# EAGLE design controllerBackup (EAGLE 9.2.2)
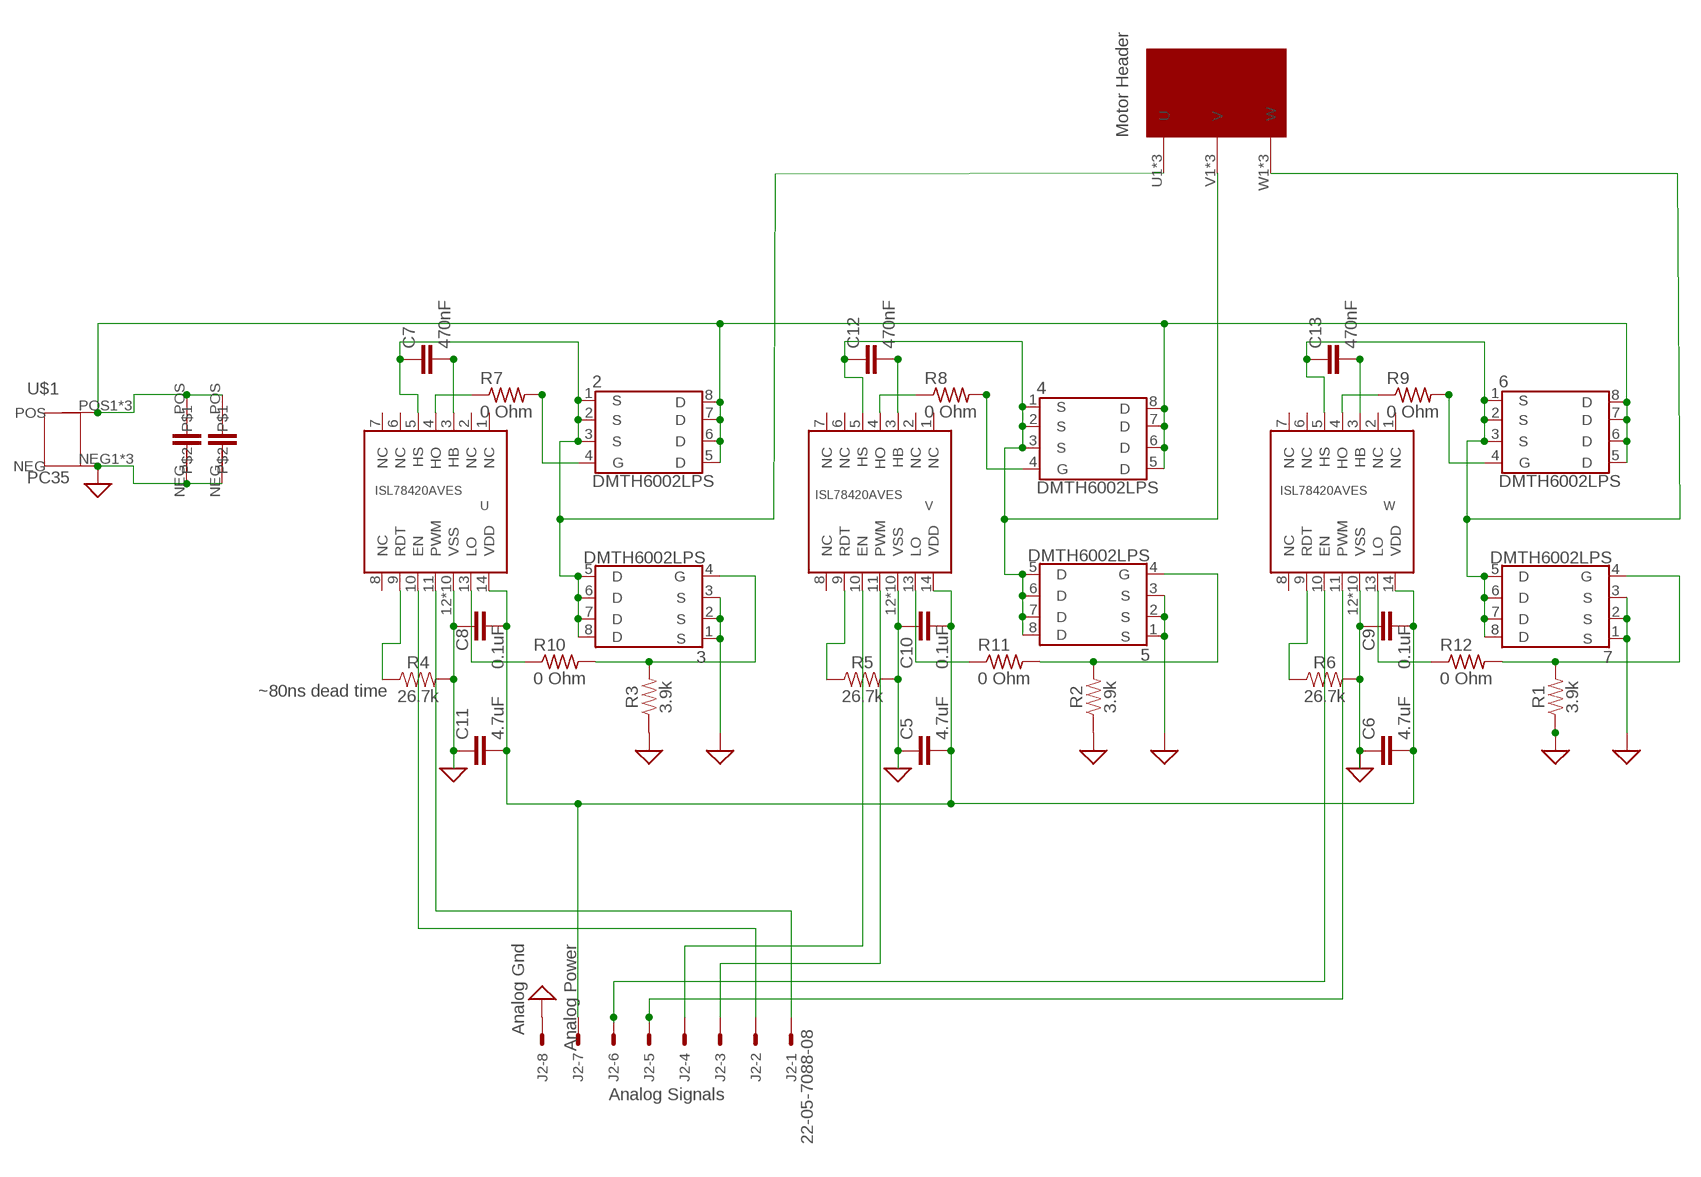
[diagram p0: schematic, sheet 1]

## Parts
2  DMTH6002LPS  [POWERDI5060]
3  DMTH6002LPS  [POWERDI5060]
4  DMTH6002LPS  [POWERDI5060]
5  DMTH6002LPS  [POWERDI5060]
6  DMTH6002LPS  [POWERDI5060]
7  DMTH6002LPS  [POWERDI5060]
C5  4.7uF  4.7UF0603  [0603]
C6  4.7uF  4.7UF0603  [0603]
C7  470nF  470NF-0402-16V-10%  [0402]
C8  0.1uF  0.1UF-0603-25V-(+80/-20%)  [0603]
C9  0.1uF  0.1UF-0603-25V-(+80/-20%)  [0603]
C10  0.1uF  0.1UF-0603-25V-(+80/-20%)  [0603]
C11  4.7uF  4.7UF0603  [0603]
C12  470nF  470NF-0402-16V-10%  [0402]
C13  470nF  470NF-0402-16V-10%  [0402]
J2  22-05-7088-08  [7395-08]
R1  3.9k  3.9KOHM-0603-1/10W-1%  [0603]
R2  3.9k  3.9KOHM-0603-1/10W-1%  [0603]
R3  3.9k  3.9KOHM-0603-1/10W-1%  [0603]
R4  26.7k  26.7KOHM0603-1/10W-1%  [0603]
R5  26.7k  26.7KOHM0603-1/10W-1%  [0603]
R6  26.7k  26.7KOHM0603-1/10W-1%  [0603]
R7  0 Ohm  R-US_R0603  [R0603]
R8  0 Ohm  R-US_R0603  [R0603]
R9  0 Ohm  R-US_R0603  [R0603]
R10  0 Ohm  R-US_R0603  [R0603]
R11  0 Ohm  R-US_R0603  [R0603]
R12  0 Ohm  R-US_R0603  [R0603]
U  ISL78420AVES  [14LDHTSSOP]
U$1  PC35  [PC35.1762741]
U$2  PC35_3  [PC35.1762754]
U$3  1mF 63V  VISHAYCAP  [MAL2146998]
U$4  1mF 63V  VISHAYCAP  [MAL2146998]
V  ISL78420AVES  [14LDHTSSOP]
W  ISL78420AVES  [14LDHTSSOP]

## Nets
0: 2.1(S) 2.2(S) 2.3(S) 3.5(D) 3.6(D) 3.7(D) 3.8(D) C7.1 U$2.U1(U) U$2.U2(U) U$2.U3(U) U.5(HS)
GND: 3.1(S) 3.2(S) 3.3(S) 5.1(S) 5.2(S) 5.3(S) 7.1(S) 7.2(S) 7.3(S) C5.1 C6.1 C8.1 C9.1 C10.1 C11.1 J2.8 R1.1 R2.1 R3.1 R4.2 R5.2 R6.2 U$1.NEG1(NEG) U$1.NEG2(NEG) U$1.NEG3(NEG) U$3.NEG U$4.NEG U.12(VSS) U.EPAD(VSS) U.P$1(VSS) U.P$2(VSS) U.P$3(VSS) U.P$4(VSS) U.P$5(VSS) U.P$6(VSS) U.P$7(VSS) U.P$8(VSS) V.12(VSS) V.EPAD(VSS) V.P$1(VSS) V.P$2(VSS) V.P$3(VSS) V.P$4(VSS) V.P$5(VSS) V.P$6(VSS) V.P$7(VSS) V.P$8(VSS) W.12(VSS) W.EPAD(VSS) W.P$1(VSS) W.P$2(VSS) W.P$3(VSS) W.P$4(VSS) W.P$5(VSS) W.P$6(VSS) W.P$7(VSS) W.P$8(VSS) ; supply symbol labelled SUP
N$1: J2.1 U.11(PWM)
N$2: R10.1 U.13(LO)
N$3: C5.2 C6.2 C8.2 C9.2 C10.2 C11.2 J2.7 U.14(VDD) V.14(VDD) W.14(VDD)
N$4: C7.2 U.3(HB)
N$5: J2.2 U.10(EN)
N$6: 4.4(G) R8.2
N$7: 2.4(G) R7.2
N$8: 3.4(G) R3.2 R10.2
N$9: J2.3 V.11(PWM)
N$11: J2.4 V.10(EN)
N$12: 5.4(G) R2.2 R11.2
N$13: 6.4(G) R9.2
N$15: 7.4(G) R1.2 R12.2
N$16: 4.1(S) 4.2(S) 4.3(S) 5.5(D) 5.6(D) 5.7(D) 5.8(D) C12.1 U$2.V1(V) U$2.V2(V) U$2.V3(V) V.5(HS)
N$17: C12.2 V.3(HB)
N$18: C13.2 W.3(HB)
N$19: 6.1(S) 6.2(S) 6.3(S) 7.5(D) 7.6(D) 7.7(D) 7.8(D) C13.1 U$2.W1(W) U$2.W2(W) U$2.W3(W) W.5(HS)
N$25: R4.1 U.9(RDT)
N$26: R5.1 V.9(RDT)
N$27: R6.1 W.9(RDT)
N$28: R8.1 V.4(HO)
N$29: R9.1 W.4(HO)
N$30: J2.5 W.11(PWM)
N$31: J2.6 W.10(EN)
N$35: R11.1 V.13(LO)
N$37: R12.1 W.13(LO)
N$38: R7.1 U.4(HO)
N$41: 2.5(D) 2.6(D) 2.7(D) 2.8(D) 4.5(D) 4.6(D) 4.7(D) 4.8(D) 6.5(D) 6.6(D) 6.7(D) 6.8(D) U$1.POS1(POS) U$1.POS2(POS) U$1.POS3(POS) U$3.POS U$4.POS
Unconnected: U.1(NC) U.2(NC) U.6(NC) U.7(NC) U.8(NC) V.1(NC) V.2(NC) V.6(NC) V.7(NC) V.8(NC) W.1(NC) W.2(NC) W.6(NC) W.7(NC) W.8(NC)

## Notes on the sheet
- ~80ns dead time
- Analog Gnd
- Analog Power
- Analog Signals

## Library data of the parts
2-7 = MC:DMTH6002LPS: Diodes Inc. N-channel MOSFET 60V, 100A
C5 C6 C11 = SparkFun-Capacitors:4.7UF: 4.7µF ceramic capacitors A capacitor is a passive two-terminal electrical component used to store electrical energy temporarily in an electric field.; PROD_ID: CAP-08280
C7 C12 C13 = SparkFun-Capacitors:470NF: 0.47uF/470nF ceramic capacitors A capacitor is a passive two-terminal electrical component used to store electrical energy temporarily in an electric field.; PROD_ID: CAP-09041
C8-C10 = SparkFun-Capacitors:0.1UF: 0.1µF ceramic capacitors A capacitor is a passive two-terminal electrical component used to store electrical energy temporarily in an electric field.; PROD_ID: CAP-00810
J2 = con-molex:22-?-08: CONNECTOR wire to board 2.54 mm (.1 inch) pitch header; MF: MOLEX; OC_FARNELL: unknown; OC_NEWARK: unknown
R1-R3 = SparkFun-Resistors:3.9KOHM: 3.9kΩ resistor A resistor is a passive two-terminal electrical component that implements electrical resistance as a circuit element. Resistors act to reduce current flow, and, at the same time, act to lower voltage levels within circuits. - Wikipedia; PROD_ID: RES-08701
R4-R6 = SparkFun-Resistors:26.7KOHM: 26.7kΩ resistor A resistor is a passive two-terminal electrical component that implements electrical resistance as a circuit element. Resistors act to reduce current flow, and, at the same time, act to lower voltage levels within circuits. - Wikipedia; PROD_ID: RES-12186
R7-R12 = adafruit:R-US_: RESISTOR, American symbol
U V W = MC:ISL78420AVES: Renesas Gate Driver 100V, 2A Peak, adjustable dead time
U$1 = MC:PC35
U$2 = MC:PC35_3
U$3 U$4 = MC:VISHAYCAP

## Board
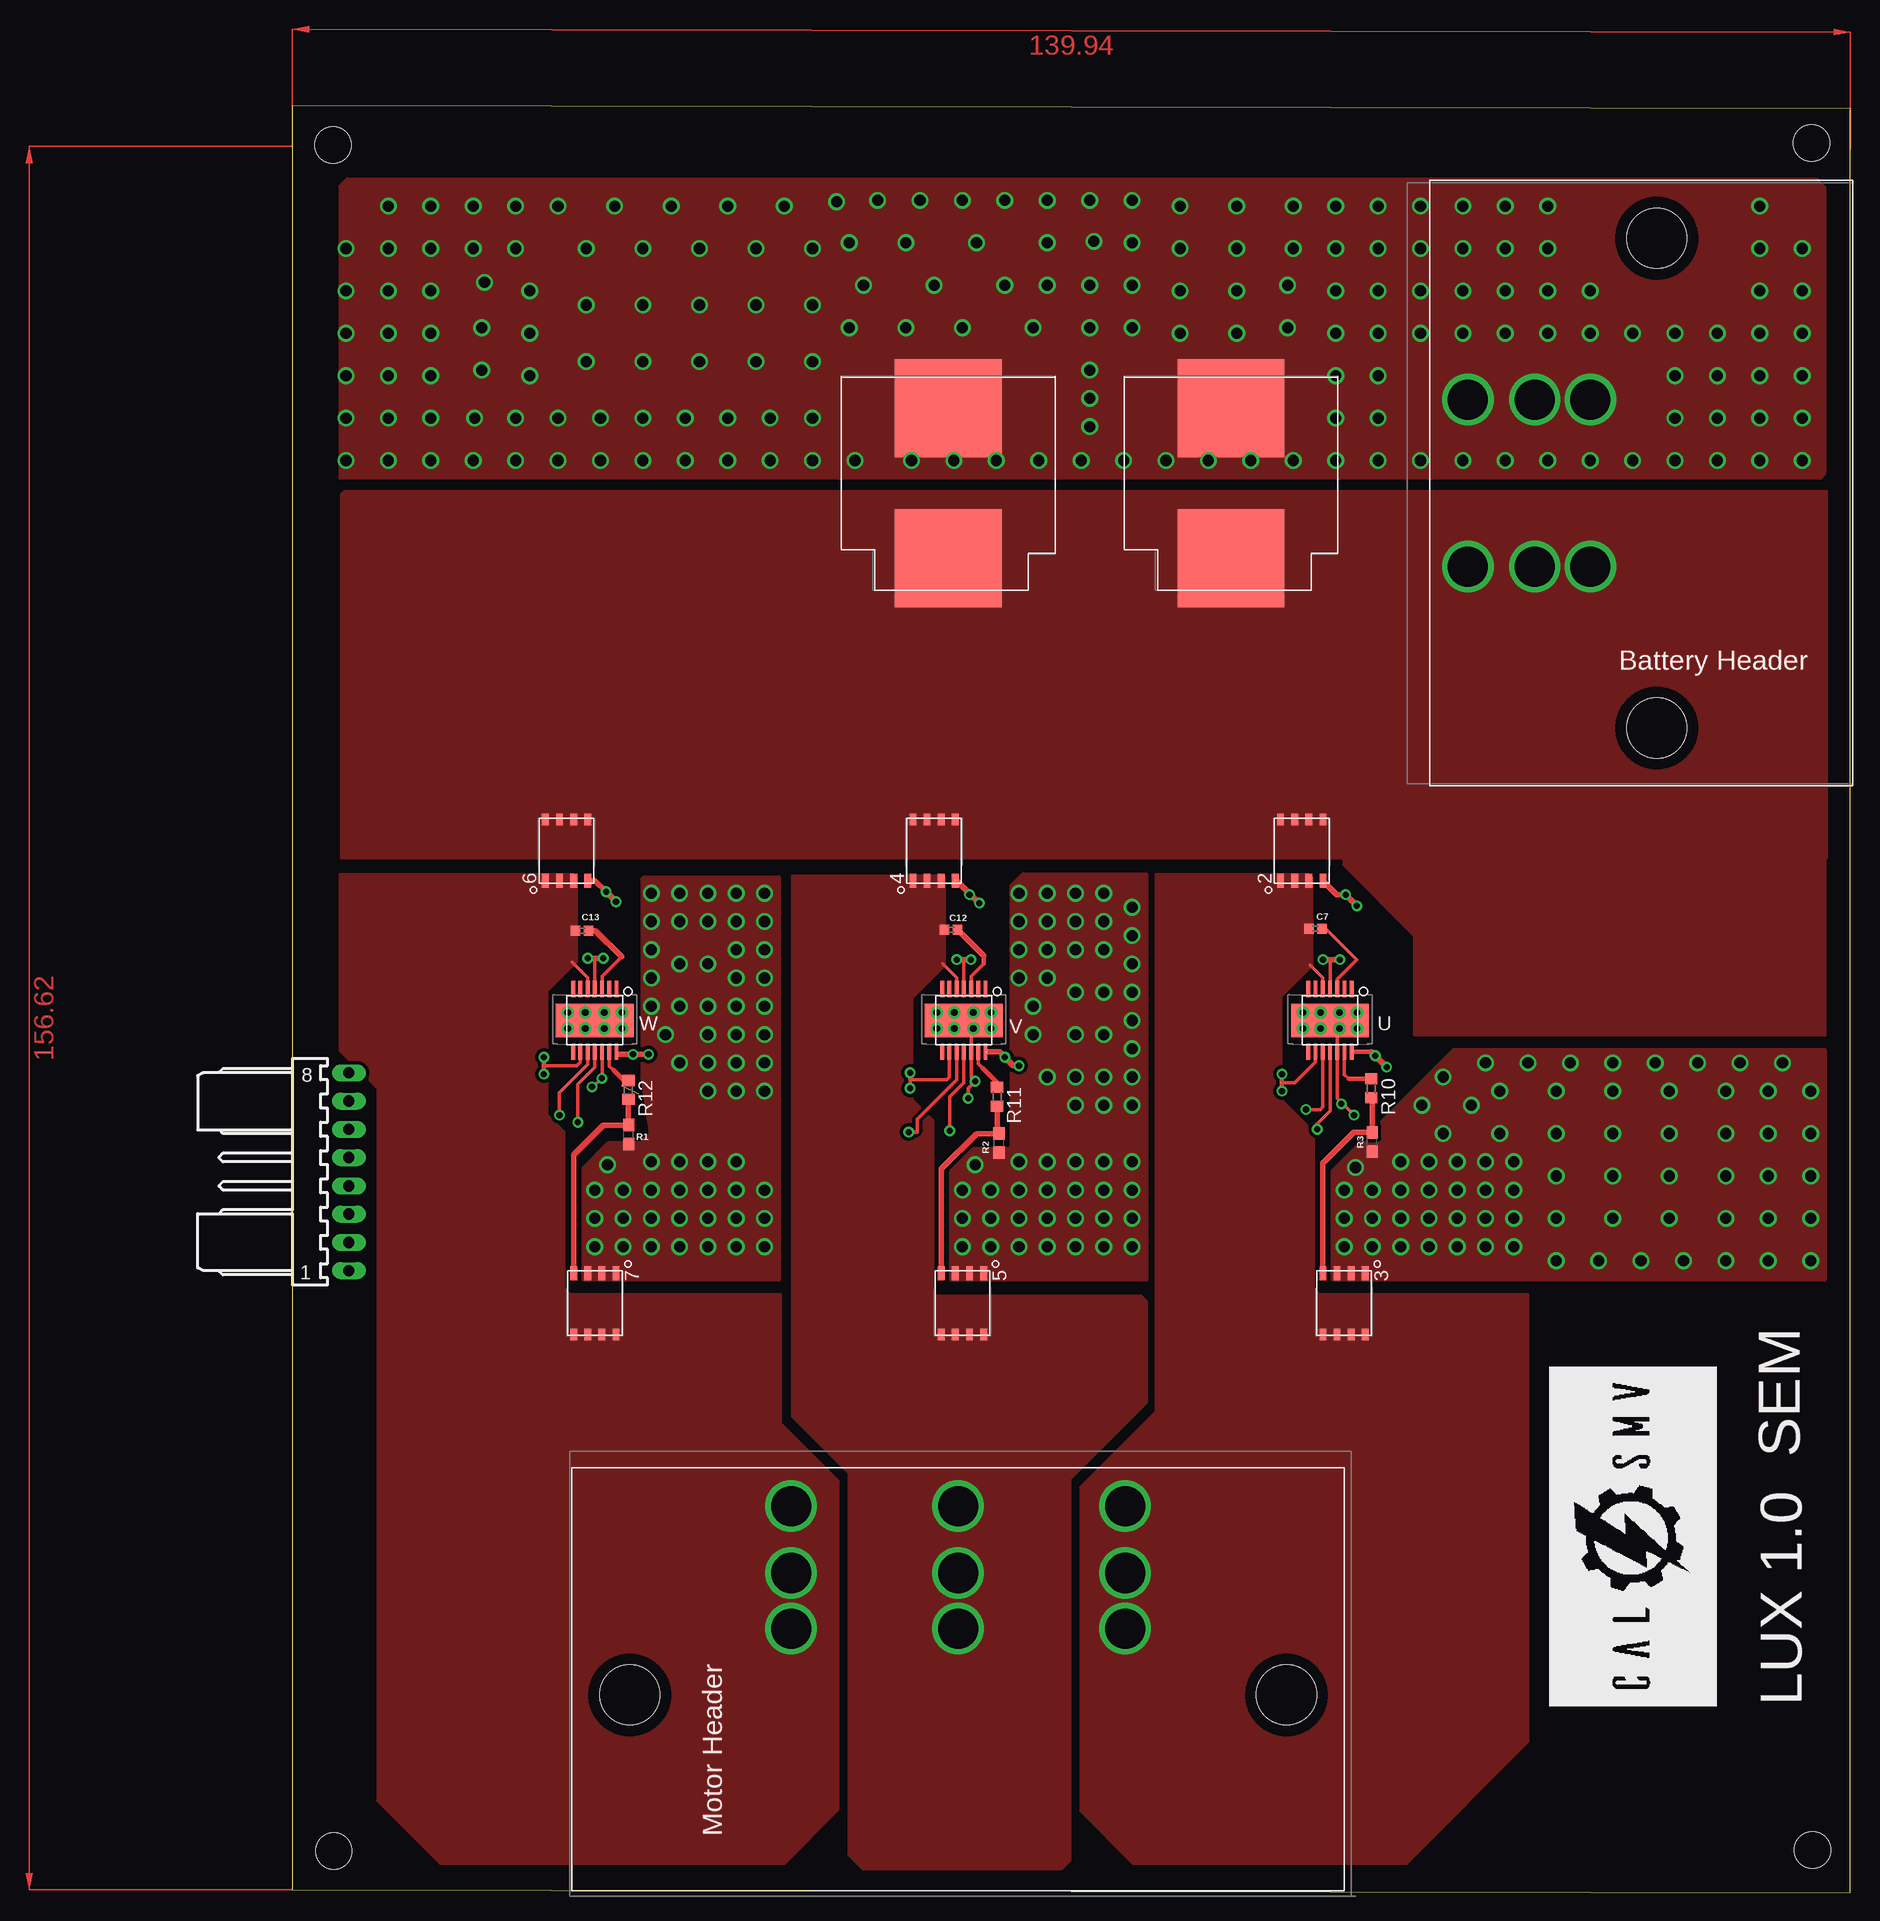
[diagram p1: board, top side]
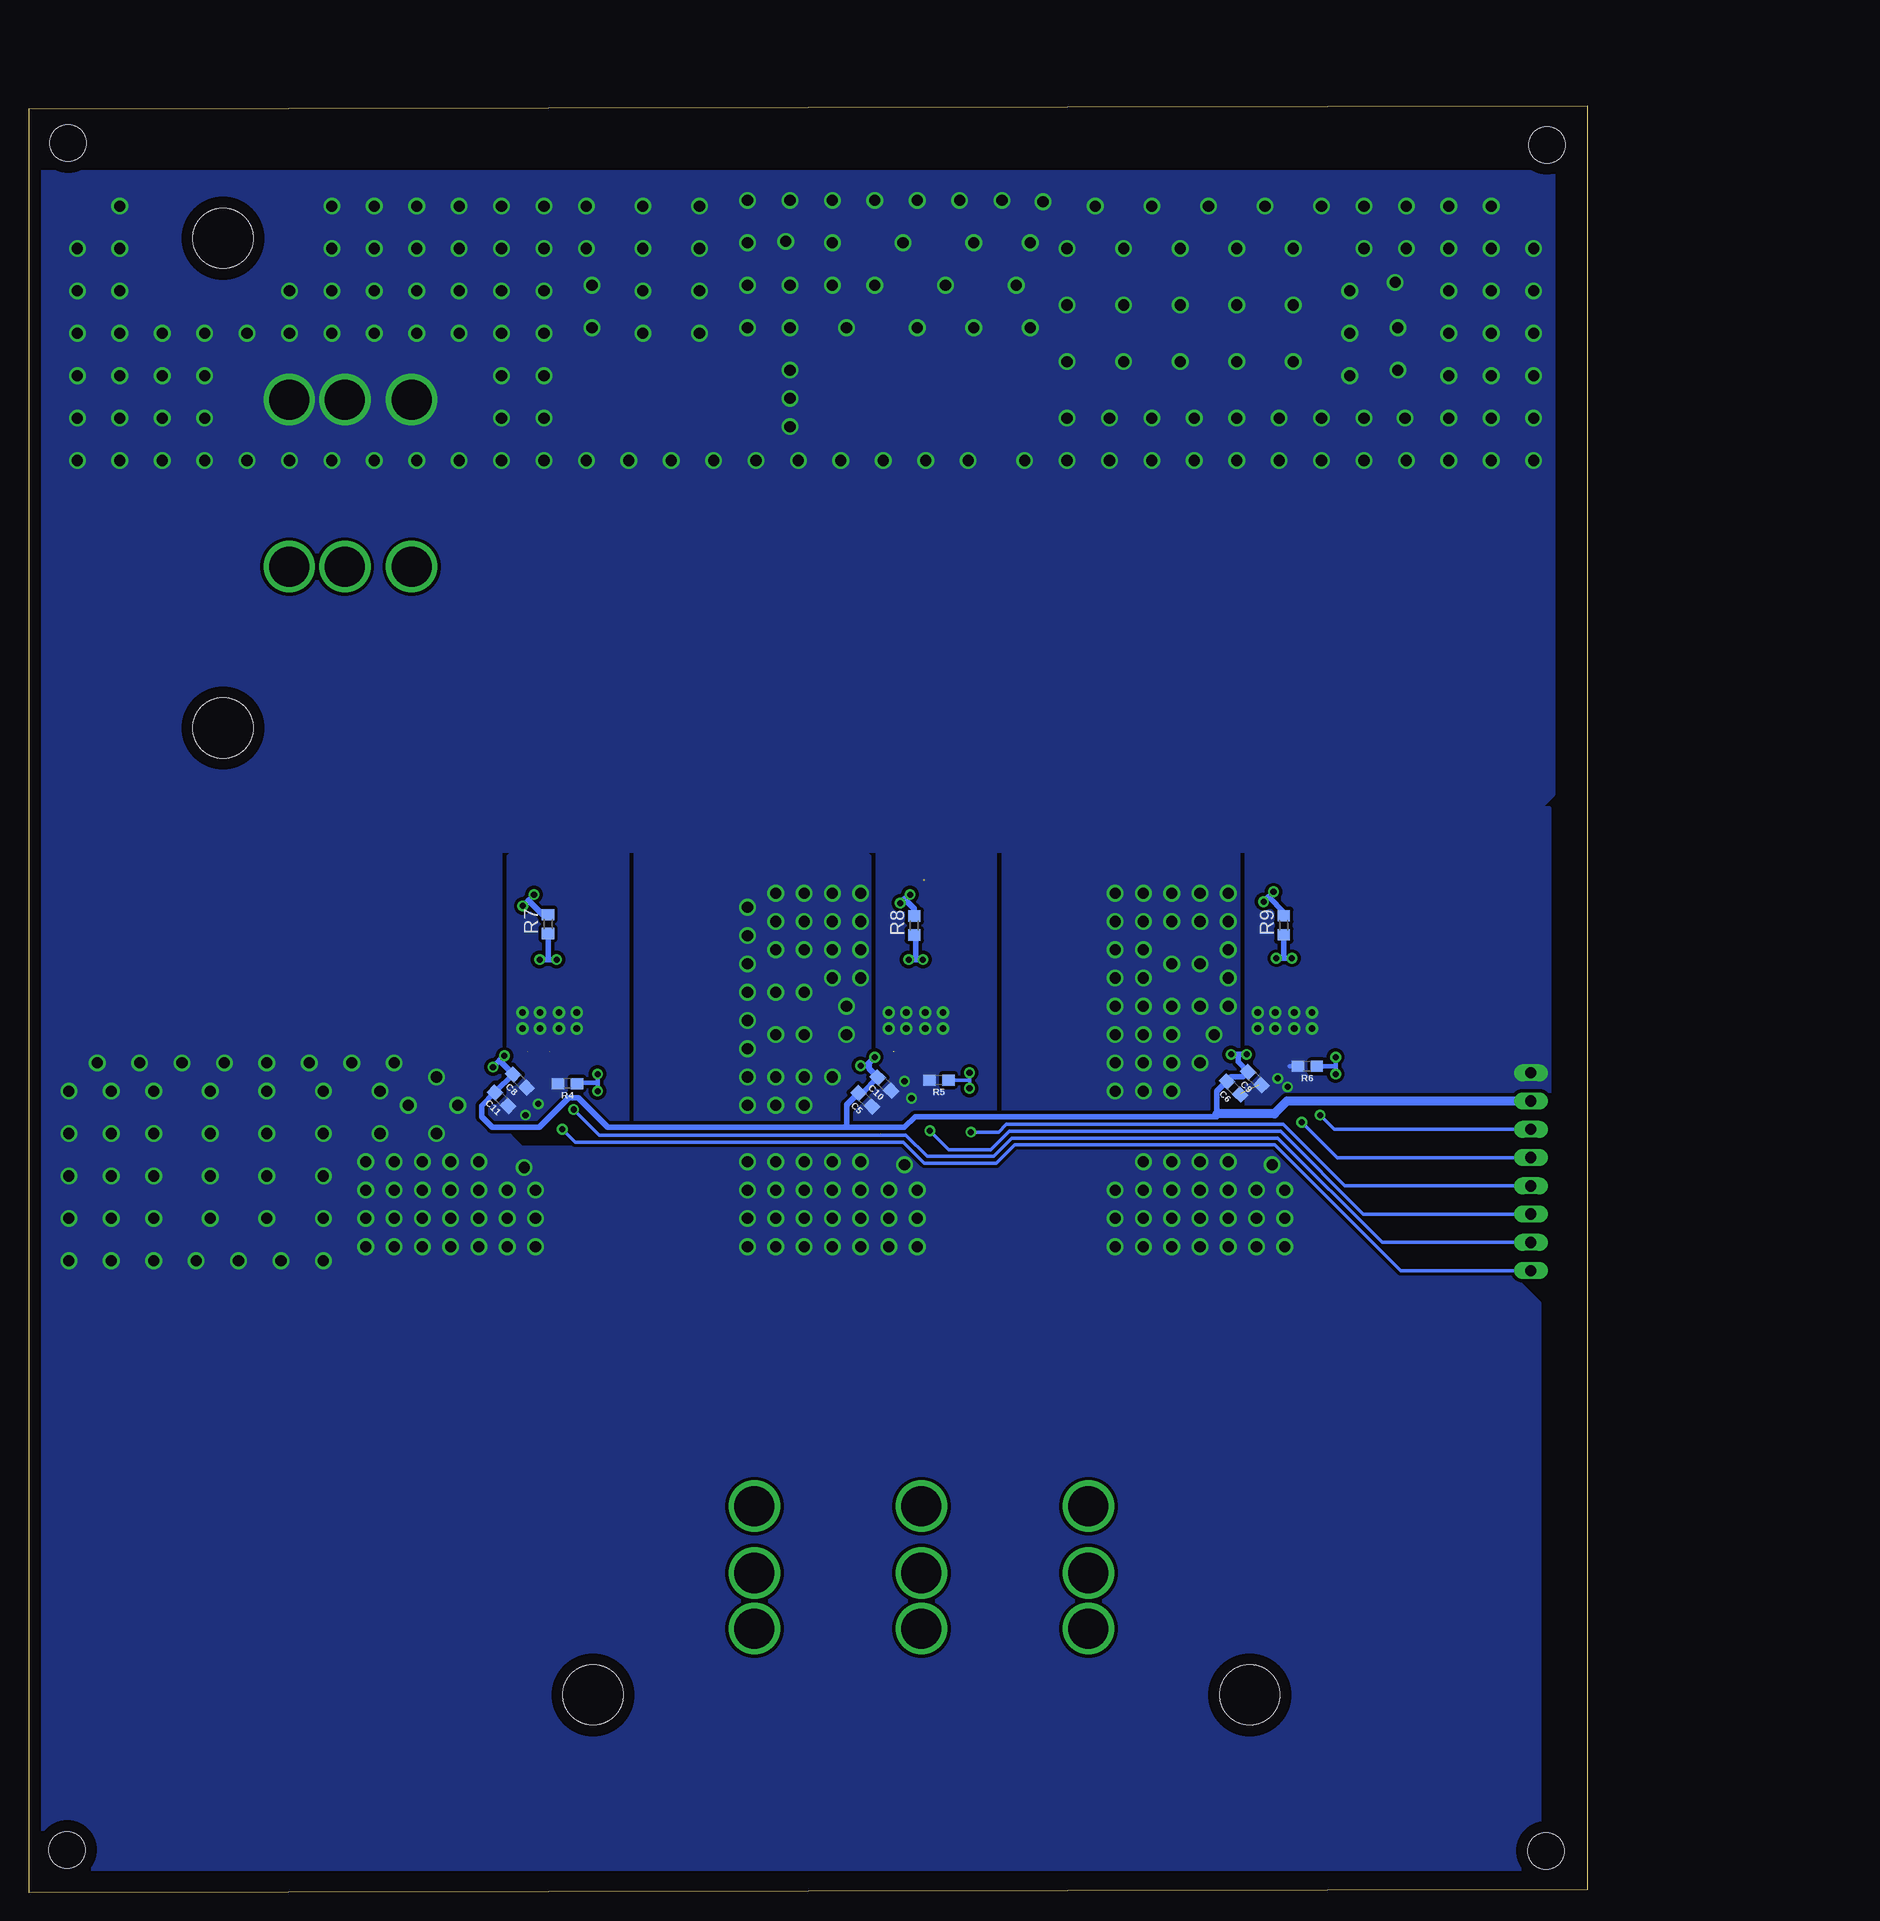
[diagram p2: board, bottom side, seen from below]

Size 139.94 x 160.51 mm. Coordinates in mm from the lower left corner, seen from the top.
Outline: 0,0.25 139.94,0 139.94,160.26 0,160.51 0,0.25
Copper layers (1*16): Top 0.035mm / dielectric 1.5mm / Bottom 0.035mm
Design rules "default *": minimum track width 12mil, minimum drill 10mil, track to track 12mil, track to pad 8mil, pad to pad 8mil, via to via 12mil, smd to smd 12mil, copper to edge 40mil, drill to drill 8mil, minimum pad ring 10mil, minimum via ring 8mil, stop-mask expansion 4mil, vias tented up to drill 0mil, thermal gap 10mil
Holes 3.26 mm at 3.73,3.77 136.55,3.85 136.47,157.17 3.64,157

### Footprints (pad centres in the part's own frame; a part is rotated, then mirrored left to right if it is on the bottom)
POWERDI5060 = smd 1.27 x 0.61: 1 -2.68,1.905; 2 -2.68,0.635; 3 -2.68,-0.635; 4 -2.68,-1.905 | smd 1.02 x 0.61: 5 2.795,-1.905; 6 2.795,-0.635; 7 2.795,0.635; 8 2.795,1.905
0603 = smd 1.1 x 1: 1 -0.85,0; 2 0.85,0
0402 = smd 0.85 x 0.9: 1 -0.58,0; 2 0.58,0
7395-08 = drill 1.016 long: 1 8.89,0; 2 6.35,0; 3 3.81,0; 4 1.27,0; 5 -1.27,0; 6 -3.81,0; 7 -6.35,0; 8 -8.89,0
R0603 = smd 1 x 1.1: 1 -0.85,0; 2 0.85,0
14LDHTSSOP = smd 0.35 x 1.45: 1 -1.95,-2.825; 2 -1.3,-2.825; 3 -0.65,-2.825; 4 0,-2.825; 5 0.65,-2.825; 6 1.3,-2.825; 7 1.95,-2.825; 8 1.95,2.825; 9 1.3,2.825; 10 0.65,2.825; 11 0,2.825; 12 -0.65,2.825; 13 -1.3,2.825; 14 -1.95,2.825 | smd 7 x 3: EPAD 0,0 | drill 0.6: P$1 0.854,0.727; P$2 2.435,0.727; P$3 -0.854,0.727; P$4 -2.435,0.727; P$5 -2.435,-0.727; P$6 -0.854,-0.727; P$7 0.854,-0.727; P$8 2.435,-0.727
PC35.1762741 = drill 3.6: NEG1 4.55,-7.5; NEG2 9.55,-7.5; NEG3 15.55,-7.5; POS1 4.55,7.5; POS2 9.55,7.5; POS3 15.55,7.5 | hole 5.4: -1.4,22; -1.4,-22
PC35.1762754 = drill 3.6: U1 4.55,-15; U2 9.55,-15; U3 15.55,-15; V1 4.55,0; V2 9.55,0; V3 15.55,0; W1 4.55,15; W2 9.55,15; W3 15.55,15 | hole 5.4: -1.4,29.5; -1.4,-29.5
MAL2146998 = smd 8.8 x 9.6: NEG 6.75,0; POS -6.75,0

### Placement (x,y rotation side)
2  90.68,93.6 90 top
3  94.49,52.96 270 top
4  57.66,93.6 90 top
5  60.2,52.96 270 top
6  24.64,93.6 90 top
7  27.18,52.96 270 top
C5  64.87,71.24 135 bottom
C6  31.79,72.29 135 bottom
C7  91.9,86.61 0 top
C8  95.89,72.92 135 bottom
C9  29.88,73.15 135 bottom
C10  63.14,72.65 135 bottom
C11  97.54,71.29 135 bottom
C12  59.18,86.5 0 top
C13  26.03,86.43 0 top
J2  5.08,64.77 270 top
R1  30.23,68.11 90 top
R2  63.49,67.35 90 top
R3  97.01,67.44 90 top
R4  91.61,72.68 180 bottom
R5  58.24,72.99 180 bottom
R6  25.15,74.24 180 bottom
R7  93.36,87.02 90 bottom
R8  60.47,86.88 90 bottom
R9  27.26,86.91 90 bottom
R10  96.93,72.26 270 top
R11  63.31,71.5 270 top
R12  30.2,72.11 270 top
U  93.22,78.36 180 top
U$1  121.16,126.62 180 top
U$2  59.82,19.18 90 top
U$3  84.33,126.62 90 top
U$4  58.93,126.62 90 top
V  60.32,78.36 180 top
W  27.18,78.36 180 top

### Tracks (layer width: path | path; a pad name or v marks a point on that pad's centre or on a via)
0
  Top 0.305: U.5 92.57,82.18 91.44,83.31
  pour Top (no thermals): 91.57,91.19 91.57,83.31 88.77,80.52 88.77,71.25 91.69,68.33 91.69,54.23 92.2,53.72 111,53.72 111,13.59 100.08,2.67 75.56,2.67 70.87,7.37 70.87,36.45 77.6,43.18 77.6,91.44 91.31,91.44
GND  (via drill 0.55, 1)  (1 unrouted)
  Top 0.305: W.12 27.83,73.17 27.05,72.39 v26.92,72.39 | v95.38,69.85 93.87,71.36 U.12 93.87,77.43 U.P$3 | v60.71,71.37 60.71,72.26 v61.34,72.9 60.97,73.26 V.12 60.97,77.43 V.P$3
  Top 0.406: 27.83,73.17 v27.81,73.15
  Bottom 0.305: R4.2 92.5,72.64
  Bottom 0.406: 63.95,70.64 C5.1 | C9.1 29.25,72.52 | C9.1 29.53,72.55 | R6.2 26.73,74.24 | C9.1 29.12,72.39
  Bottom 0.508: C6.1 31.12,71.75
  other vias: 17.27,144.65 75.44,148.21 17.02,140.59 16.38,132.46 75.44,144.4 48.89,151.89 52.58,152.02 60.2,152.02 17.02,136.78 56.39,152.02 94.49,58.04 104.65,65.66 97.03,58.04 99.57,58.04 102.11,65.66 99.57,65.66 50.04,148.21 51.31,144.4 71.63,140.59 66.55,140.59 60.2,140.59 55.12,140.59 50.04,140.59 57.66,144.4 64.01,144.4 71.63,144.4 72.01,148.34 67.82,148.21 61.47,148.21 55.12,148.21 135.64,128.65 94.49,60.58 104.65,58.04 102.11,58.04 102.11,60.58 99.57,60.58 97.03,60.58 104.65,60.58 104.65,63.12 102.11,63.12 99.57,63.12 97.03,63.12 94.49,63.12 107.19,65.66 107.19,58.04 107.19,60.58 107.19,63.12 109.73,65.66 109.73,58.04 109.73,60.58 109.73,63.12 94.23,70.87 95.5,65.15 60.2,58.04 70.36,65.66 62.74,58.04 65.28,58.04 67.82,65.66 65.28,65.66 60.2,60.58 70.36,58.04 67.82,58.04 67.82,60.58 65.28,60.58 62.74,60.58 70.36,60.58 70.36,63.12 67.82,63.12 65.28,63.12 62.74,63.12 60.2,63.12 72.9,65.66 72.9,58.04 72.9,60.58 72.9,63.12 61.34,65.41 75.44,58.04 75.44,60.58 75.44,63.12 89.41,144.4 27.18,58.04 37.34,65.66 29.72,58.04 32.26,58.04 34.8,65.66 32.26,65.66 27.18,60.58 37.34,58.04 34.8,58.04 34.8,60.58 32.26,60.58 29.72,60.58 37.34,60.58 37.34,63.12 34.8,63.12 32.26,63.12 29.72,63.12 27.18,63.12 39.88,65.66 39.88,58.04 39.88,60.58 39.88,63.12 28.32,65.41 42.42,58.04 42.42,60.58 42.42,63.12 89.41,140.59 131.83,128.65 128.02,128.65 124.21,128.65 120.4,128.65 116.59,128.65 112.78,128.65 108.97,128.65 105.16,128.65 101.35,128.65 97.54,128.65 93.73,128.65 89.92,128.65 86.11,128.65 82.3,128.65 78.49,128.65 74.68,128.65 70.87,128.65 67.06,128.65 63.25,128.65 59.44,128.65 55.63,128.65 50.55,128.65 135.64,132.46 135.64,136.27 135.64,140.08 135.64,143.89 135.64,147.7 131.83,151.51 112.78,151.51 108.97,151.51 131.83,132.46 128.02,132.46 128.02,136.27 128.02,140.08 131.83,140.08 131.83,136.27 131.83,143.89 131.83,147.7 124.21,140.08 124.21,136.27 124.21,132.46 120.4,140.08 116.59,140.08 112.78,140.08 108.97,140.08 105.16,140.08 101.35,140.08 116.59,143.89 112.78,143.89 112.78,147.7 108.97,143.89 108.97,147.7 105.16,143.89 105.16,147.7 105.16,151.51 101.35,151.51 101.35,147.7 101.35,143.89 97.54,132.46 97.54,136.27 97.54,140.08 97.54,143.89 97.54,147.7 97.54,151.51 93.73,151.51 89.92,151.51 93.73,147.7 93.73,143.89 93.73,140.08 93.73,136.27 93.73,132.46 46.74,128.65 42.93,128.65 39.12,128.65 35.31,128.65 31.5,128.65 27.69,128.65 23.88,128.65 20.07,128.65 16.26,128.65 12.45,128.65 8.64,128.65 4.83,128.65 4.83,132.46 4.83,136.27 4.83,140.08 4.83,143.89 4.83,147.7 8.64,151.51 12.45,151.51 16.26,151.51 20.07,151.51 23.88,151.51 8.64,132.46 8.64,136.27 8.64,140.08 8.64,143.89 8.64,147.7 12.45,147.7 12.45,143.89 12.45,140.08 12.45,136.27 12.45,132.46 20.07,132.46 21.34,136.27 21.34,140.08 21.34,143.89 20.07,147.7 84.84,151.51 79.76,151.51 89.92,147.7 84.84,147.7 79.76,147.7 84.84,143.89 84.84,140.08 79.76,140.08 79.76,143.89 71.63,134.24 28.96,151.51 34.04,151.51 39.12,151.51 44.2,151.51 46.74,132.46 46.74,137.54 46.74,142.62 41.66,142.62 41.66,137.54 39.12,132.46 35.31,132.46 31.5,132.46 27.69,132.46 26.42,137.54 31.5,137.54 36.58,137.54 36.58,142.62 31.5,142.62 26.42,142.62 26.42,147.7 41.66,147.7 46.74,147.7 36.58,147.7 31.5,147.7 113.54,56.77 117.35,56.77 121.16,56.77 124.97,56.77 128.78,56.77 132.59,56.77 136.4,56.77 136.4,60.58 136.4,64.39 136.4,68.2 136.4,72.01 133.86,74.55 130.05,74.55 126.24,74.55 122.43,74.55 118.62,74.55 114.81,74.55 111,74.55 107.19,74.55 103.38,73.28 101.47,70.74 113.54,60.58 113.54,64.39 113.54,68.2 118.62,68.2 123.7,68.2 128.78,68.2 132.59,60.58 132.59,64.39 128.78,64.39 123.7,64.39 118.62,64.39 118.62,60.58 123.7,60.58 128.78,60.58 132.59,68.2 132.59,72.01 128.78,72.01 123.7,72.01 118.62,72.01 113.54,72.01 108.46,72.01 108.46,68.2 103.38,68.2 105.92,70.74 75.44,65.66 75.44,70.74 72.9,70.74 70.36,70.74 75.44,73.28 72.9,73.28 70.36,73.28 67.82,73.28 66.55,77.09 75.44,75.82 75.44,78.36 75.44,80.9 75.44,83.44 75.44,85.98 75.44,88.52 72.9,89.79 70.36,89.79 67.82,89.79 65.28,89.79 65.28,87.25 65.28,84.71 65.28,82.17 66.55,79.63 72.9,77.09 72.9,80.9 72.9,84.71 72.9,87.25 70.36,77.09 70.36,80.9 70.36,84.71 70.36,87.25 67.82,87.25 67.82,84.71 67.82,82.17 39.88,72.01 37.34,72.01 39.88,74.55 37.34,74.55 34.8,74.55 39.88,77.09 39.88,79.63 39.88,82.17 39.88,84.71 39.88,87.25 39.88,89.79 37.34,89.79 34.8,89.79 32.26,89.79 32.26,87.25 32.26,84.71 32.26,82.17 32.26,79.63 33.53,77.09 37.34,77.09 37.34,79.63 34.8,79.63 37.34,83.44 34.8,83.44 34.8,87.25 37.34,87.25 71.63,136.78 71.63,131.7 75.44,140.59 23.88,132.46 42.93,132.46 64.01,152.02 67.82,152.02 71.63,152.02 75.44,152.02 67.82,144.4 16.26,147.7 42.42,72.01 42.42,74.55 42.42,77.09 42.42,79.63 42.42,82.17 42.42,84.71 42.42,87.25 42.42,89.79
  pour Top (no thermals): 59.18,55.12 59.18,64.77 61.21,66.8 64.64,66.8 64.64,90.42 65.66,91.44 76.71,91.44 76.71,55.12
  pour Top (no thermals): 26.16,55.12 26.16,65.02 28.45,67.31 31.37,67.31 32.26,68.2 31.48,73.25 31.48,91.04 31.62,91.19 35.81,91.19 43.69,91.18 43.69,55.12
  pour Top (no thermals): 93.47,55.12 93.47,64.77 104.39,75.69 137.67,75.69 137.67,55.12
  pour Top (no thermals): 4.32,127.13 137.29,127.13 137.67,127.51 137.67,153.16 136.91,153.92 4.95,153.92 4.32,153.29
  pour Bottom (no thermals): 18.29,66.93 4.32,52.96 4.32,2.16 138.94,2.16 138.94,154.56 3.05,154.56 3.05,98.68 8.13,93.6 97.66,93.6 97.66,68.83 95.76,66.93
  pour Bottom (no thermals): 30.58,94.01 30.58,69.25 5.81,69.25 3.44,71.61 3.44,97.41 27.18,97.41
  pour Bottom: 33.53,69.47 52.58,69.47 52.58,94.87 31.88,94.87 31.24,94.23 31.24,74.3 33.53,72.01
  pour Bottom: 66.55,68.2 85.6,68.2 85.6,93.6 64.9,93.6 64.39,93.09 64.39,72.9 66.55,70.74
  pour Bottom (no thermals): 53.09,93.85 53.09,69.6 60.71,69.6 61.47,68.83 66.04,68.83 66.17,68.96 66.17,69.85 63.86,72.16 63.86,93.5 63.5,93.85
  pour Bottom (no thermals): 86.11,93.6 86.11,69.34 86.87,68.58 99.06,68.58 99.19,68.71 99.19,69.6 97.03,71.75 97.03,93.09 96.52,93.6
N$1  (via drill 0.55)  (1 unrouted)
  Top 0.305: U.11 93.22,70.23 92.08,69.09 v92.08,68.58
  Bottom 0.305: J2.1 16.76,55.88 28.07,67.18 51.43,67.18 53.09,65.53 59.56,65.53 61.47,67.44 90.93,67.44 v92.08,68.58
N$2
  Top 0.305: 96.89,73.15 R10.1 | U.13 94.52,73.49 94.9,73.1
  Top 0.406: 94.9,73.1 R10.1
N$3  (via drill 0.55)  (2 unrouted)
  Top 0.305: W.14 29.35,75.31
  Top 0.406: 96.93,75.53 95.2,75.53
  Top 0.508: v32,75.31 v30.61,75.31 29.35,75.31 | v98.3,74.17 v97.28,75.18 96.93,75.53 | v65.28,74.3 64.77,74.3 v64.01,75.06 63.53,75.53 62.34,75.53
  Bottom 0.406: 65.15,71.84 C5.2
  Bottom 0.508: v30.61,75.31 31.37,75.31 | 31.37,75.31 v32,75.31 | 31.37,75.31 31.37,74.63 C9.2 30.95,73.28 32,73.28 C6.2 33.27,72 33.27,69.98 33.27,69.72 60.38,69.72 61.35,68.76 66.55,68.76 | 65.15,71.84 C10.2 64.52,74.03 64.52,74.55 | 66.55,68.76 87.99,68.76 90.63,71.39 91.49,71.39 94.13,68.76 98.35,68.76 99.31,69.72 99.31,70.71 C11.2 96.5,73.52 C8.2 97.7,74.74 97.73,74.74 | C5.2 66.55,70.77 66.55,68.76 | v64.01,75.06 64.52,74.55 | 64.52,74.55 64.77,74.3 v65.28,74.3 | v97.28,75.18 97.73,74.74 | 97.73,74.74 v98.3,74.17
  Bottom 0.813: J2.7 26.98,71.12 28.12,69.98 33.27,69.98
N$4
  Top 0.305: U.3 93.87,82.06 95.63,83.82 92.84,86.61 C7.2
N$5  (via drill 0.55)
  Top 0.305: v91.06,70.36 92.33,70.36 92.57,70.6 U.10
  Bottom 0.305: J2.2 18.44,58.42 27.81,67.79 51.69,67.79 53.34,66.14 59.31,66.14 61.21,68.05 88.75,68.05 v91.06,70.36
N$6  (via drill 0.55)  (1 unrouted)
  Top 0.406: v60.83,89.66 60.95,89.66 | v61.72,88.9 v61.71,88.9
  Top 0.508: v61.71,88.9 60.95,89.66 59.56,91.05
  Bottom 0.406: v60.83,89.66 60.96,89.66 61.34,89.28 v61.72,88.9 | R8.2 60.47,88.41
  Bottom 0.508: 60.47,88.41 61.34,89.28
N$7  (via drill 0.55)
  Top 0.508: 2.4 93.84,89.66 v94.61,89.66 v95.63,88.65
  Bottom 0.406: v94.61,89.66 95.12,89.15 v95.63,88.65 | R7.2 93.84,87.87
  Bottom 0.508: 93.84,87.87 95.12,89.15
N$8
  Top 0.305: R10.2 97.01,71.32
  Top 0.508: 3.4 92.58,65.53 95.34,68.29 R3.2 97.01,71.32
N$9  (via drill 0.55)
  Top 0.305: V.11 60.32,72.77 59.05,71.5 v59.05,68.45
  Bottom 0.305: J2.3 20.12,60.96 27.56,68.4 51.94,68.4 53.59,66.75 57.35,66.75 v59.05,68.45
N$11  (via drill 0.55)
  Top 0.305: v55.37,68.33 56.13,68.33 56.13,69.47 59.67,73.01 V.10
  Bottom 0.305: J2.4 21.8,63.5 27.31,69.01 52.19,69.01 52.88,68.33 v55.37,68.33
N$12  (1 unrouted)
  Top 0.406: 63.31,68.38 R2.2
  Top 0.508: R2.2 61.47,68.2 58.29,65.02 5.4 | R11.2 63.31,68.38
N$13  (via drill 0.55)
  Top 0.508: 6.4 27.19,90.92 v28.19,89.92 v29.08,89.03
  Bottom 0.508: v29.08,89.03 28.64,89.47 | 28.64,89.47 v28.19,89.92 | R9.2 27.26,88.1 28.64,89.47
N$15
  Top 0.406: 30.2,68.99 R1.2
  Top 0.508: R12.2 30.2,68.99 | R1.2 27.94,68.96 25.27,66.29 7.4
N$16
  Top 0.305: V.5 59.67,82.18 58.42,83.44
  Top 0.406: 58.42,86.32 C12.1
  pour Top (no thermals): 58.42,91.31 44.96,91.31 44.96,42.8 50.04,37.72 50.04,3.43 51.31,2.16 69.09,2.16 69.85,2.92 69.85,37.21 76.71,44.07 76.71,53.09 76.2,53.59 57.66,53.59 57.53,53.72 57.53,69.34 55.63,71.25 55.63,80.39 58.55,83.31 58.55,91.19
N$17
  Top 0.305: V.3 60.97,82.31 62.1,83.44
  Top 0.406: 62.1,83.44 62.1,84.15
  Top 0.508: 62.1,84.15 C12.2
N$18
  Top 0.305: W.3 27.83,82.31 29.59,84.07
  Top 0.508: 29.59,84.07 27.23,86.43 C13.2
N$19
  Top 0.305: W.5 26.53,82.18 25.15,83.57
  Top 0.406: C13.1 25.27,86.26
  pour Top (no thermals): 23.37,49.15 27.94,53.72 43.81,53.72 43.81,41.78 44.32,41.27 31.24,41.27
  pour Top (no thermals): 25.53,91.19 25.53,83.69 22.86,81.03 22.86,69.85 24.38,68.33 24.38,54.23 24.89,53.72 32.26,53.72 49.02,36.96 49.02,7.49 44.2,2.67 13.33,2.67 7.75,8.25 7.75,72.26 4.32,75.69 4.32,91.44 25.27,91.44
N$25  (via drill 0.55)
  Top 0.305: U.9 91.9,75.52 91.9,74.62 90.05,72.77 88.9,72.77
  Top 0.406: v88.9,73.53 88.9,72.77 v88.9,72.01
  Bottom 0.406: v88.9,73.53 88.9,72.77 | 88.9,72.77 v88.9,72.01 | R4.1 90.68,72.77 88.9,72.77
N$26  (via drill 0.55)
  Top 0.305: V.9 59.02,73.25 58.8,73.03 55.5,73.03 v55.5,72.26
  Top 0.406: v55.5,73.66 55.5,73.03
  Bottom 0.305: v55.5,73.66 55.5,72.9 | 55.5,72.9 v55.5,72.26 | R5.1 55.59,72.99 55.5,72.9
N$27  (via drill 0.55)
  Top 0.305: W.9 25.86,75.52 25.86,74.62 25.54,74.3 22.61,74.3
  Top 0.406: v22.61,75.06 22.61,74.3 v22.61,73.53
  Bottom 0.406: v22.61,75.06 22.61,74.17 | 22.61,74.17 v22.61,73.53 | R6.1 22.67,74.24 22.61,74.17
N$28  (via drill 0.55)
  Top 0.305: V.4 60.32,83.82
  Top 0.508: v59.69,83.82 60.32,83.82 v60.96,83.82
  Bottom 0.406: R8.1 60.32,85.89
  Bottom 0.508: v59.69,83.82 60.32,83.82 | 60.32,83.82 v60.96,83.82 | 60.32,85.89 60.32,83.82
N$29  (via drill 0.55)
  Top 0.305: W.4 27.18,83.95
  Top 0.508: v26.54,83.95 27.18,83.95 v27.94,83.95
  Bottom 0.508: v27.94,83.95 27.3,83.95 | 27.3,83.95 v26.54,83.95 | R9.1 27.26,83.99 27.3,83.95
N$30  (via drill 0.55)
  Top 0.305: W.11 27.18,74.17 25.65,72.64 v25.65,69.22
  Bottom 0.305: J2.5 22.48,66.04 v25.65,69.22
N$31  (via drill 0.55)
  Top 0.305: W.10 26.53,74.41 24,71.88 v24,69.85
  Bottom 0.305: J2.6 22.73,68.58 v24,69.85
N$35
  Top 0.305: V.13 61.62,74.46 61.97,74.12
  Top 0.406: 61.97,74.12 63.31,72.78 63.31,72.6
  Top 0.508: 63.31,72.6 R11.1
N$37
  Top 0.305: R12.1 30.04,72.97 | W.13 28.48,74.27 28.83,73.91
  Top 0.406: 28.83,73.91 29.78,72.97 R12.1
N$38  (via drill 0.55)
  Top 0.305: U.4 93.22,83.82
  Top 0.508: v92.58,83.82 93.22,83.82 v94.11,83.82
  Bottom 0.508: v92.58,83.82 93.34,83.82 | 93.34,83.82 v94.11,83.82 | R7.1 93.36,83.83 93.34,83.82
N$41
  pour Top (no thermals): 137.8,92.96 4.44,92.96 4.44,125.6 4.7,125.86 137.8,125.86
  pour Top: 118.62,121.54 103.38,121.54 97.03,115.19 97.03,96.14 94.49,93.6 94.49,92.33 100.84,85.98 100.84,77.09 137.67,77.09 137.67,102.49
(copper drawn outside any net)
  shapes: Top area x2

### Text on the board
tPlace: SEM | LUX 1.0